# Altium schematic sheet Display_OLED.SchDoc
size A2
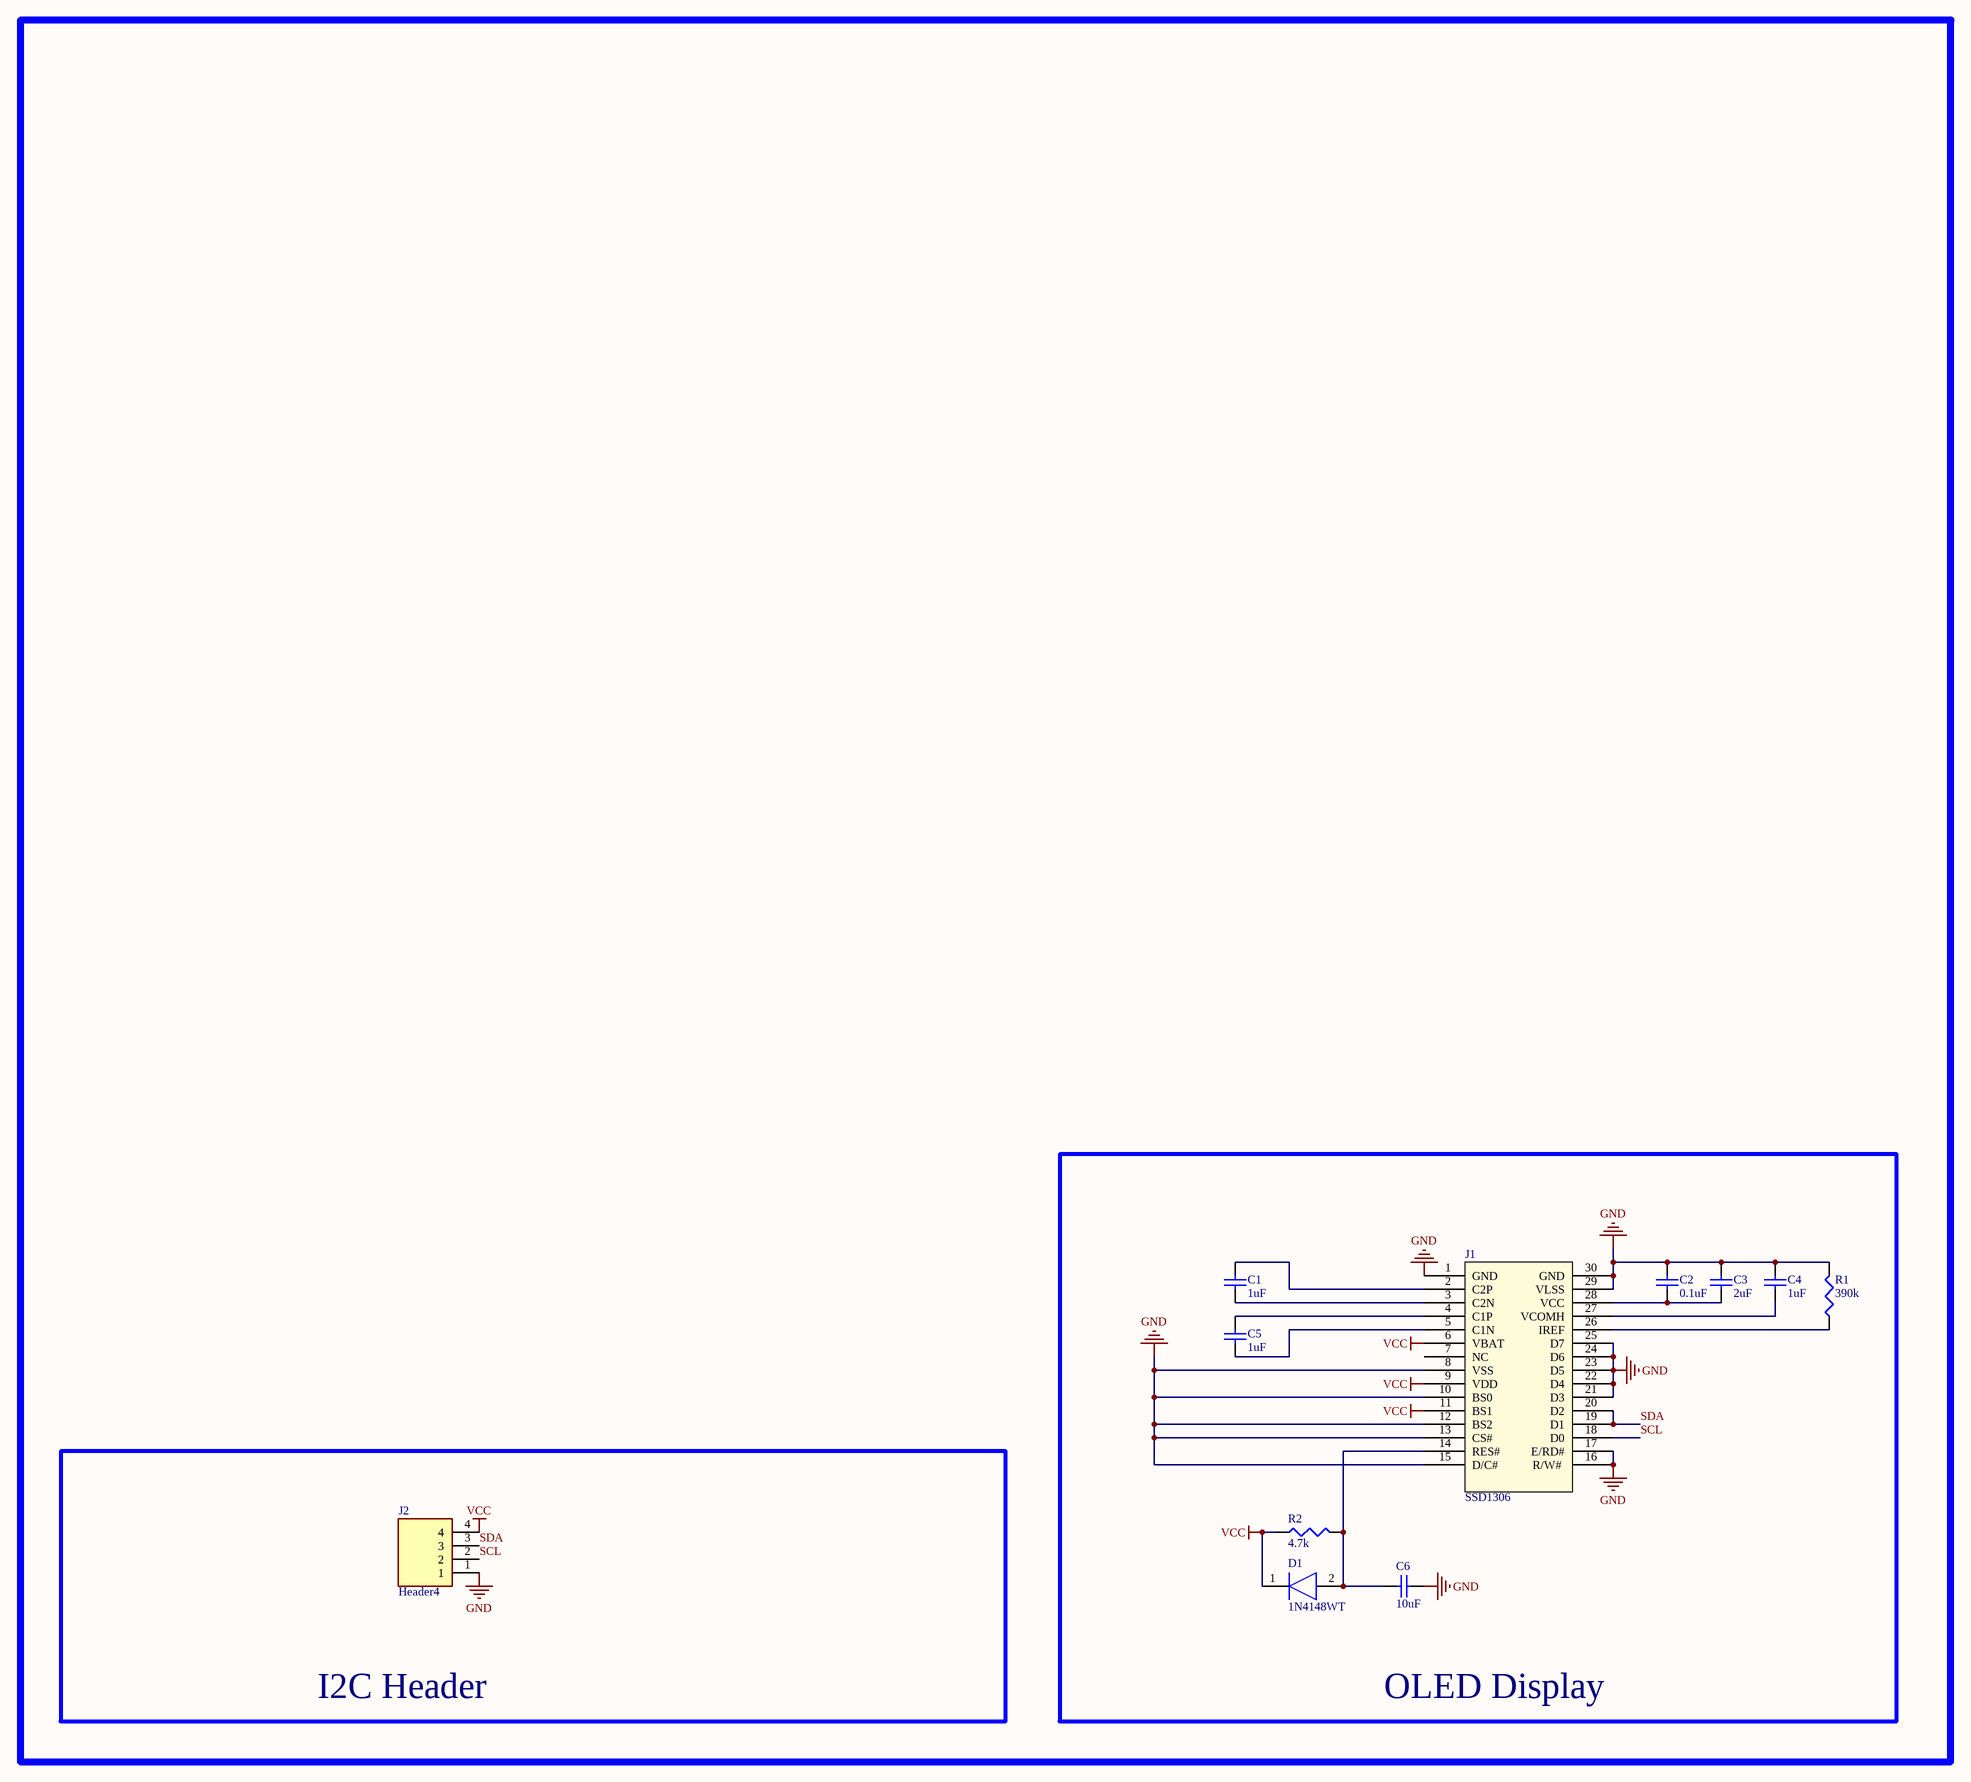
[diagram p0: Display_OLED.SchDoc]

## Parts
C1  1uF  [0603]
C2  0.1uF  [0603]
C3  2uF  [0603]
C4  1uF  [0603]
C5  1uF  [0603]
C6  10uF  [0603]
D1  1N4148WT  [SODFL1608X70N]
J1  SSD1306  [Header30]
J2  Header4  [HDRV4W165P0X396_1X4_1508X1020X1425P]
R1  390k  [0603]
R2  4.7k  [0603]

## Blocks framed on the sheet
OLED Display: C1-C6 D1 J1 R1 R2
I2C Header: J2

## Nets
GND: C2.1 C3.1 C4.1 C6.2 J1.1(GND) J1.8(VSS) J1.10(BS0) J1.12(BS2) J1.13(CS#) J1.15(D/C#) J1.16(R/W#) J1.17(E/RD#) J1.21(D3) J1.22(D4) J1.23(D5) J1.24(D6) J1.25(D7) J1.29(VLSS) J1.30(GND) J2.1 R1.2
VCC: D1.1(K) J1.6(VBAT) J1.9(VDD) J1.11(BS1) J2.4 R2.1
SCL: J1.18(D0) J2.2
SDA: J1.19(D1) J1.20(D2) J2.3
NetC1_1: C1.1 J1.2(C2P)
NetC1_2: C1.2 J1.3(C2N)
NetC2_2: C2.2 C3.2 J1.28(VCC)
NetC4_2: C4.2 J1.27(VCOMH)
NetC5_1: C5.1 J1.4(C1P)
NetC5_2: C5.2 J1.5(C1N)
NetC6_1: C6.1 D1.2(A) J1.14(RES#) R2.2
NetJ1_26: J1.26(IREF) R1.1

Not connected (* = marked no-connect by the designer): J1 7(NC)

## Library data of the parts
C1-C6 = Cap: Capacitor; Value: 0.01uF; Published: 8-Jun-2000; LatestRevisionDate: 17-Jul-2002; LatestRevisionNote: Re-released for DXP Platform.; PackageReference: RAD-0.3; Publisher: Altium Limited
D1 = 1N4148WT: Diode; Manufacturer_Name: SEMTECH; Datasheet Link: https://datasheet.lcsc.com/szlcsc/Semtech-1N4148WT_C27748.pdf; Height: 0.7mm; Manufacturer_Part_Number: 1N4148WT
J1 = Header_SMD_30
J2 = Header4: Connector; Manufacturer_Name: Molex; Manufacturer_Part_Number: 0009652048; Datasheet Link: https://www.molex.com/pdm_docs/sd/009652048_sd.pdf; Height: 14.25mm; Mouser Part Number: N/A; Mouser Price/Stock: https://www.mouser.co.uk/ProductDetail/Molex/0009652048?qs=PBcRNPEHKsr%252BMEGD33m%2F9w%3D%3D; Arrow Part Number: 0009652048; Arrow Price/Stock: https://www.arrow.com/en/products/0009652048/molex; System: Connector; Syatem: connector
R1 R2 = Res: Resistor; Value: 22; Published: 8-Jun-2000; LatestRevisionDate: 29-May-2009; LatestRevisionNote: IPC-7351 Footprint Added.; PackageReference: J1-0603; Publisher: Altium Limited; PackageDescription: Chip Resistor